# EAGLE design main (EAGLE 9.6.1)
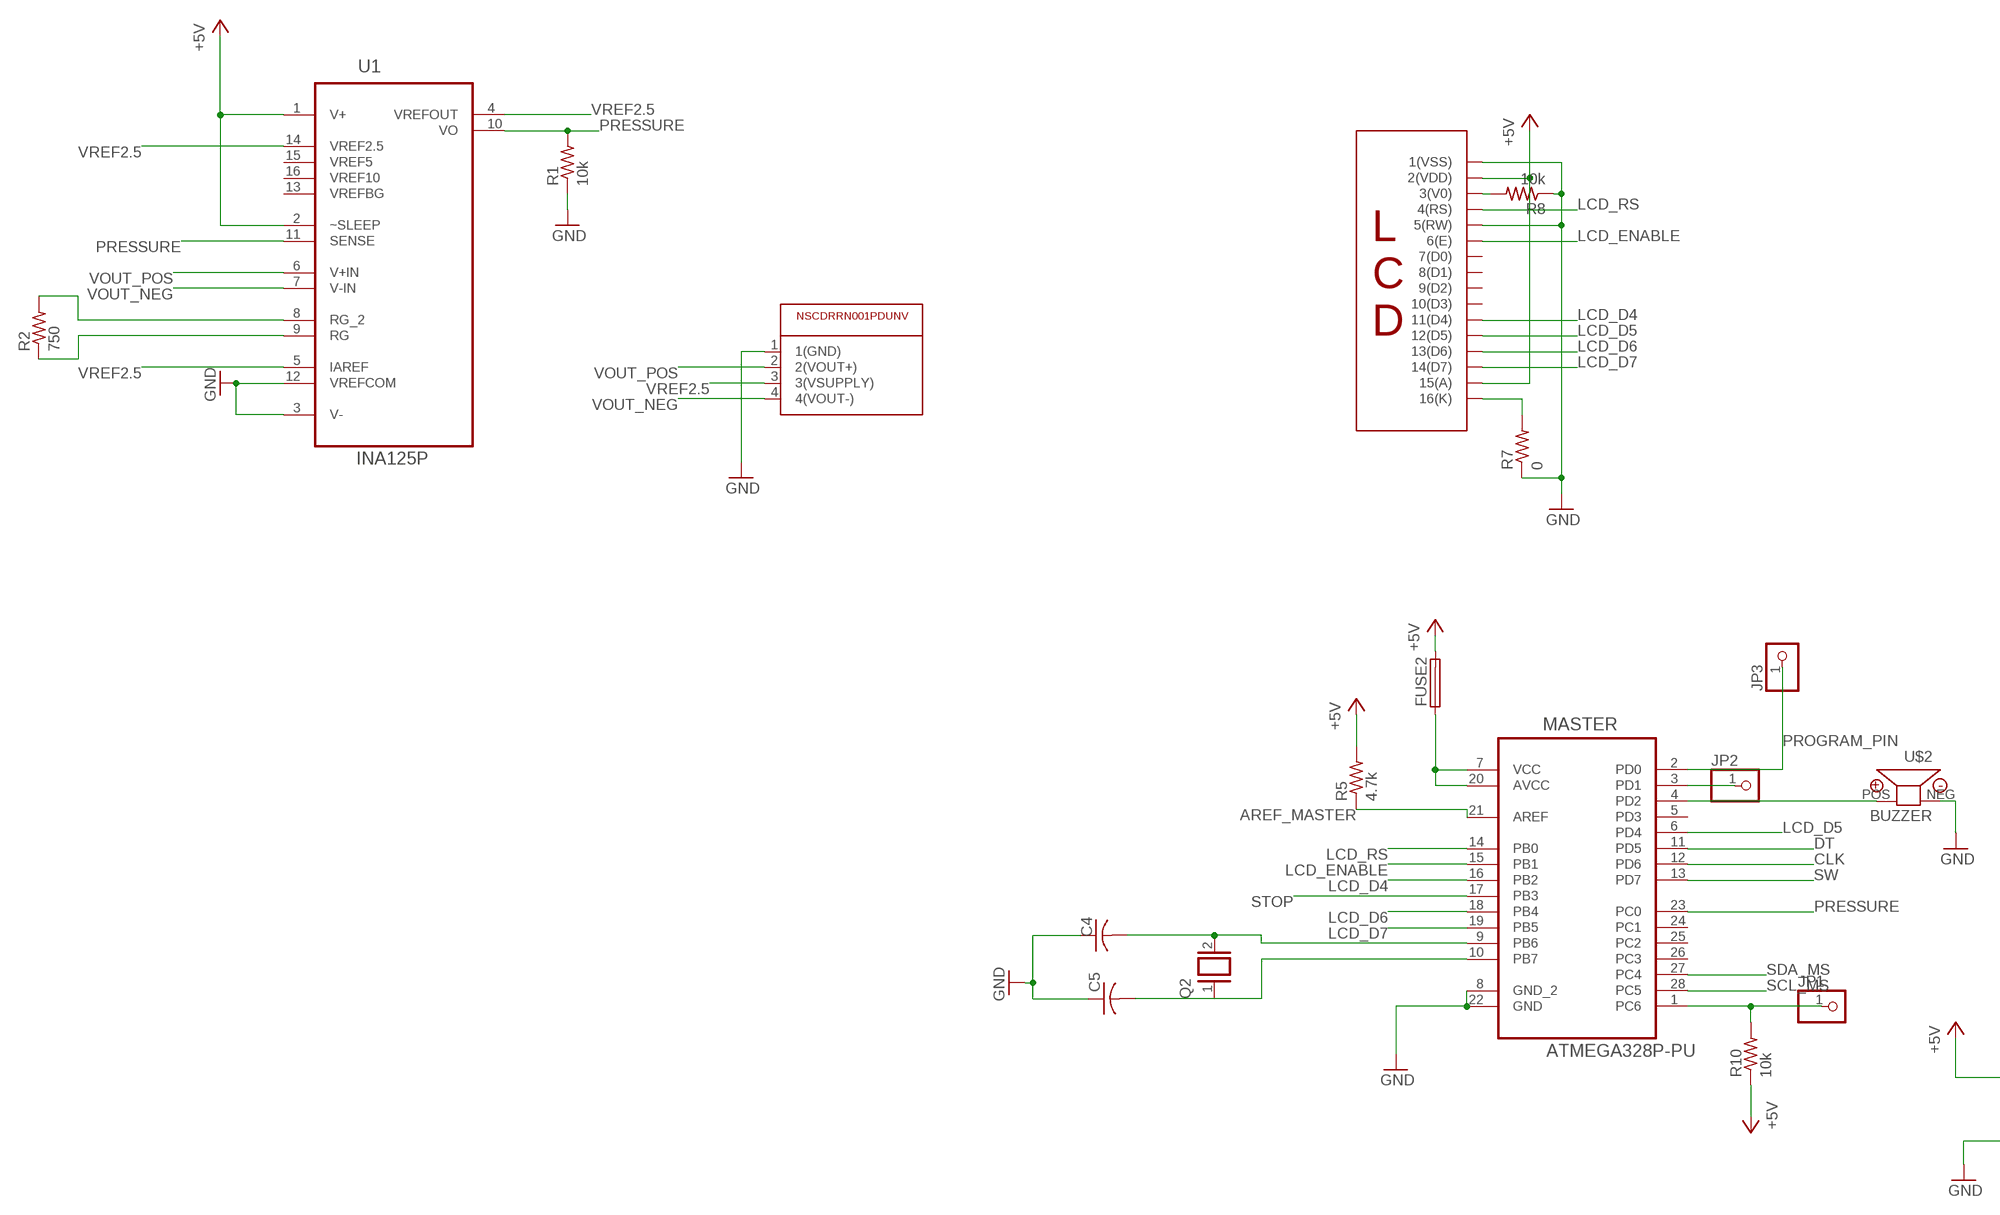
[diagram p0: schematic, sheet 1, part 1 of 2]
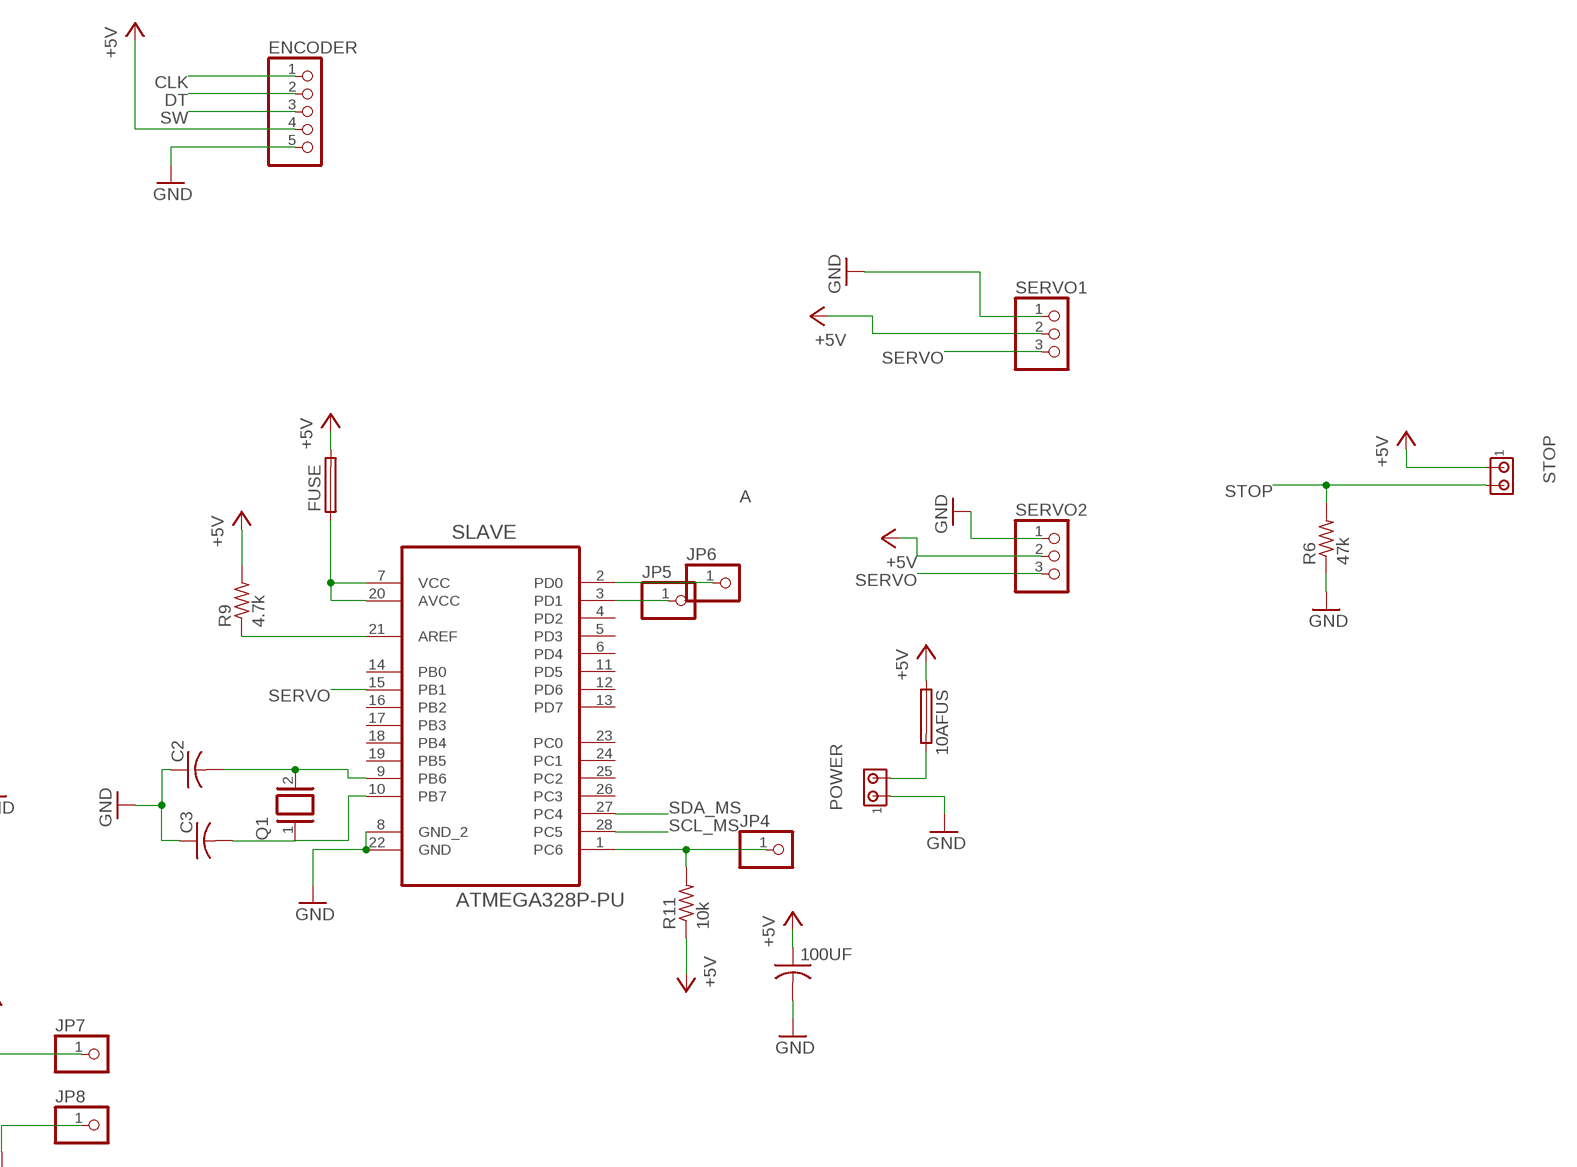
[diagram p1: schematic, sheet 1, part 2 of 2]

## Parts
10AFUS  FUSE050-075X075  [C050-075X075]
100UF  5MM_CAPACITOR050-075X075  [C050-075X075]
C2  5MM_CAPACITOR050-075X075  [C050-075X075]
C3  5MM_CAPACITOR050-075X075  [C050-075X075]
C4  5MM_CAPACITOR050-075X075  [C050-075X075]
C5  5MM_CAPACITOR050-075X075  [C050-075X075]
ENCODER  PINHD-1X5  [1X05]
FUSE  FUSE050-075X075  [C050-075X075]
FUSE2  FUSE050-075X075  [C050-075X075]
JP1  PINHD-1X1  [1X01]
JP2  PINHD-1X1  [1X01]
JP3  PINHD-1X1  [1X01]
JP4  PINHD-1X1  [1X01]
JP5  PINHD-1X1  [1X01]
JP6  PINHD-1X1  [1X01]
JP7  PINHD-1X1  [1X01]
JP8  PINHD-1X1  [1X01]
MASTER  ATMEGA328P-PU  [DIP254P762X457-28]
POWER  MTA02-156  [1X2MTA]
Q1  XTAL/S  [QS]
Q2  XTAL/S  [QS]
R1  10k  R-US_0207/10  [0207/10]
R2  750  R-US_0207/10  [0207/10]
R5  4.7k  R-US_0207/10  [0207/10]
R6  47k  R-US_0207/10  [0207/10]
R7  0  R-US_0207/10  [0207/10]
R8  10k  R-US_0207/10  [0207/10]
R9  4.7k  R-US_0207/10  [0207/10]
R10  10k  R-US_0207/10  [0207/10]
R11  10k  R-US_0207/10  [0207/10]
SERVO1  PINHD-1X3/90  [1X03/90]
SERVO2  PINHD-1X3/90  [1X03/90]
SLAVE  ATMEGA328P-PU  [DIP254P762X457-28]
STOP  MTA02-156  [1X2MTA]
U1  INA125P  [DIP254P762X508-16]
U$1  LCD  [1X16]
U$2  BUZZER  [BUZZER]
U$3  PRESSURE_SENSOR  [DIP8-WIDE]

## Nets
+5V: 10AFUS.1 100UF.1 ENCODER.4 FUSE2.2 FUSE.2 JP7.1 R5.2 R9.2 R10.1 R11.1 SERVO1.2 SERVO2.2 STOP.1 U1.1(V+) U1.2(~SLEEP) U$1.2(2(VDD)) U$1.15(15(A))
A: JP6.1 SLAVE.2(PD0)
AREF_MASTER: MASTER.21(AREF) R5.1
CLK: ENCODER.1 MASTER.12(PD6)
DT: ENCODER.2 MASTER.11(PD5)
GND: 100UF.2 C2.1 C3.1 C4.1 C5.1 ENCODER.5 JP8.1 MASTER.8(GND_2) MASTER.22(GND) POWER.1 R1.1 R6.1 R7.1 R8.1 SERVO1.1 SERVO2.1 SLAVE.8(GND_2) SLAVE.22(GND) U1.3(V-) U1.12(VREFCOM) U$1.1(1(VSS)) U$1.5(5(RW)) U$2.NEG U$3.1(1(GND))
LCD_D4: MASTER.16(PB2) U$1.11(11(D4))
LCD_D5: MASTER.6(PD4) U$1.12(12(D5))
LCD_D6: MASTER.18(PB4) U$1.13(13(D6))
LCD_D7: MASTER.19(PB5) U$1.14(14(D7))
LCD_ENABLE: MASTER.15(PB1) U$1.6(6(E))
LCD_RS: MASTER.14(PB0) U$1.4(4(RS))
N$1: JP2.1 MASTER.3(PD1)
N$2: FUSE2.1 MASTER.7(VCC) MASTER.20(AVCC)
N$4: FUSE.1 SLAVE.7(VCC) SLAVE.20(AVCC)
N$5: 10AFUS.2 POWER.2
N$6: R2.2 U1.8(RG_2)
N$7: C2.2 Q1.2 SLAVE.9(PB6)
N$8: C3.2 Q1.1 SLAVE.10(PB7)
N$9: JP1.1 MASTER.1(PC6) R10.2
N$10: JP4.1 R11.2 SLAVE.1(PC6)
N$11: C4.2 MASTER.9(PB6) Q2.2
N$12: JP5.1 SLAVE.3(PD1)
N$13: MASTER.4(PD2) U$2.POS
N$14: C5.2 MASTER.10(PB7) Q2.1
N$16: R7.2 U$1.16(16(K))
N$17: R8.2 U$1.3(3(V0))
N$18: R2.1 U1.9(RG)
N$19: R9.1 SLAVE.21(AREF)
PRESSURE: MASTER.23(PC0) R1.2 U1.10(VO) U1.11(SENSE)
PROGRAM_PIN: JP3.1 MASTER.2(PD0)
SCL_MS: MASTER.28(PC5) SLAVE.28(PC5)
SDA_MS: MASTER.27(PC4) SLAVE.27(PC4)
SERVO: SERVO1.3 SERVO2.3 SLAVE.15(PB1)
STOP: MASTER.17(PB3) R6.2 STOP.2
SW: ENCODER.3 MASTER.13(PD7)
VOUT_NEG: U1.7(V-IN) U$3.4(4(VOUT-))
VOUT_POS: U1.6(V+IN) U$3.2(2(VOUT+))
VREF2.5: U1.4(VREFOUT) U1.5(IAREF) U1.14(VREF2.5) U$3.3(3(VSUPPLY))
Unconnected: MASTER.5(PD3) MASTER.24(PC1) MASTER.25(PC2) MASTER.26(PC3) SLAVE.4(PD2) SLAVE.5(PD3) SLAVE.6(PD4) SLAVE.11(PD5) SLAVE.12(PD6) SLAVE.13(PD7) SLAVE.14(PB0) SLAVE.16(PB2) SLAVE.17(PB3) SLAVE.18(PB4) SLAVE.19(PB5) SLAVE.23(PC0) SLAVE.24(PC1) SLAVE.25(PC2) SLAVE.26(PC3) U$1.7(7(D0)) U$1.8(8(D1)) U$1.9(9(D2)) U$1.10(10(D3))

## Power pins joined to a net without a drawn wire
VREF5: U1.15(VREF5)
VREF10: U1.16(VREF10)
VREFBG: U1.13(VREFBG)

## Library data of the parts
10AFUS FUSE FUSE2 = e-vent:FUSE: CAPACITOR, American symbol
100UF C2-C5 = e-vent:5MM_CAPACITOR: CAPACITOR, American symbol
ENCODER = pinhead:PINHD-1X5: PIN HEADER
JP1-JP8 = pinhead:PINHD-1X1: PIN HEADER
MASTER SLAVE = e-vent:ATMEGA328P-PU: 8-bit Microcontroller with In-System Programmable Flash; AVAILABILITY: Unavailable; DESCRIPTION: AVR AVR® ATmega Microcontroller IC 8-Bit 20MHz 32KB _16K x 16_ FLASH 28-PDIP; MF: Microchip; MP: ATMEGA328P-PU; PACKAGE: PDIP-28 Microchip; PRICE: None
POWER STOP = con-amp:MTA02-156: AMP connector
Q1 Q2 = e-vent:XTAL/S: CRYSTAL
R1 R2 R5-R11 = rcl:R-US_: RESISTOR, American symbol; SPICEPREFIX: R
SERVO1 SERVO2 = pinhead:PINHD-1X3: PIN HEADER
U1 = e-vent:INA125P: INSTRUMENTATION AMPLIFIER; AVAILABILITY: Unavailable; DESCRIPTION: Instrumentation Amplifier 1 Circuit 16-PDIP; MF: Texas Instruments; MP: INA125P; PACKAGE: DIP-16 Burr Brown; PRICE: None
U$1 = e-vent:LCD
U$2 = e-vent:BUZZER
U$3 = e-vent:PRESSURE_SENSOR

## Board
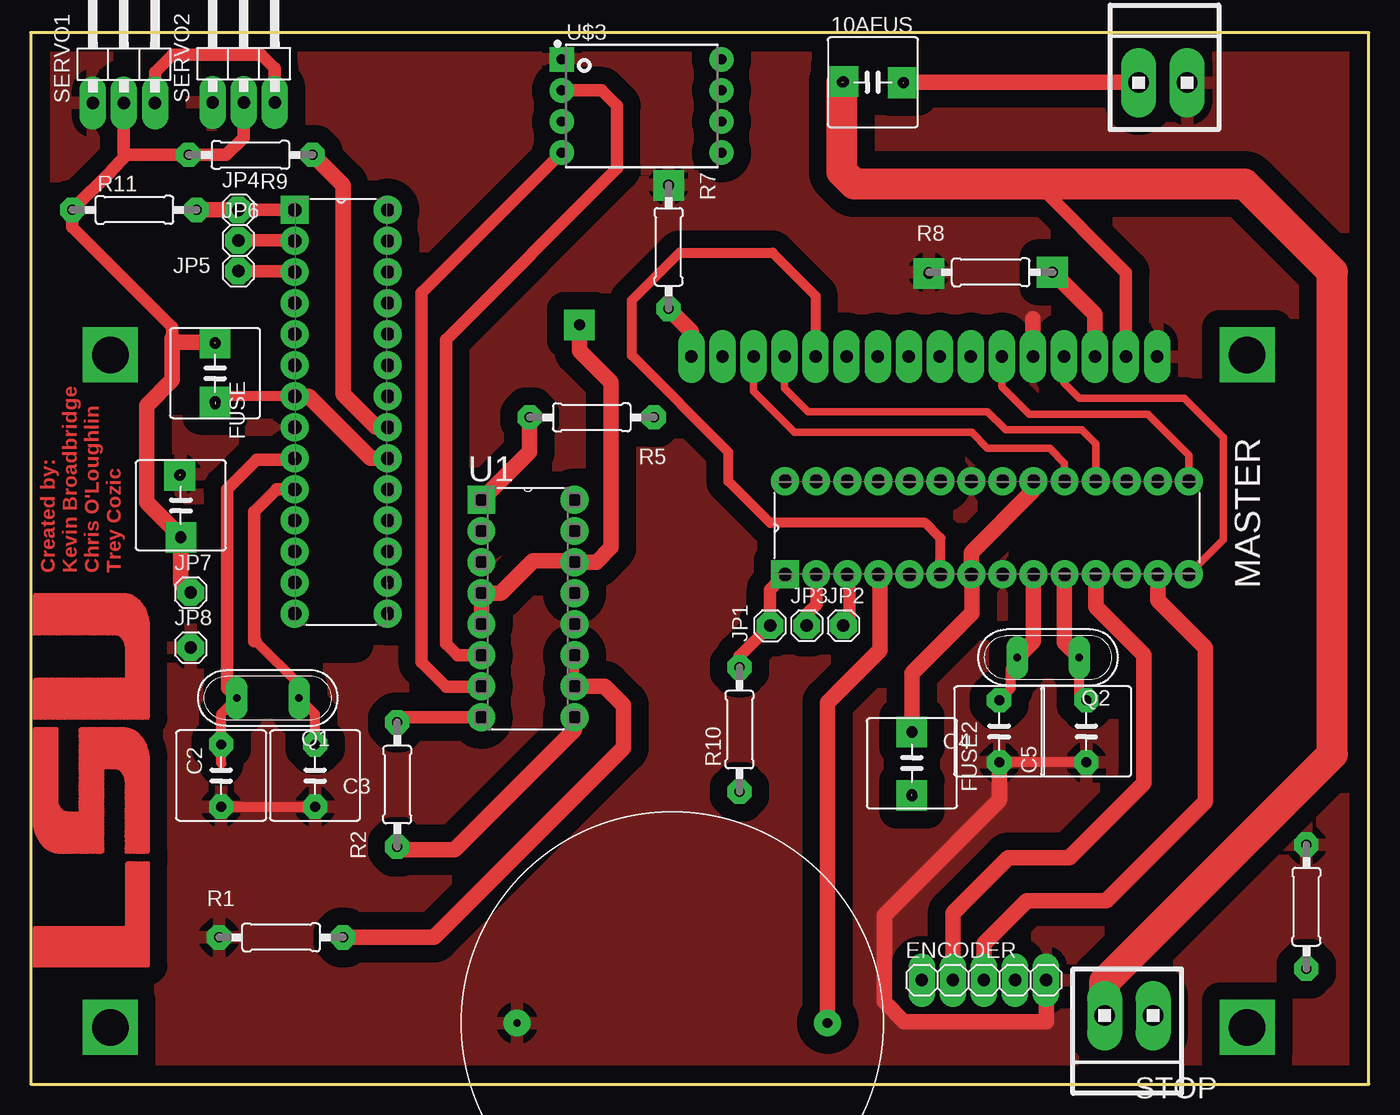
[diagram p2: board, top side]
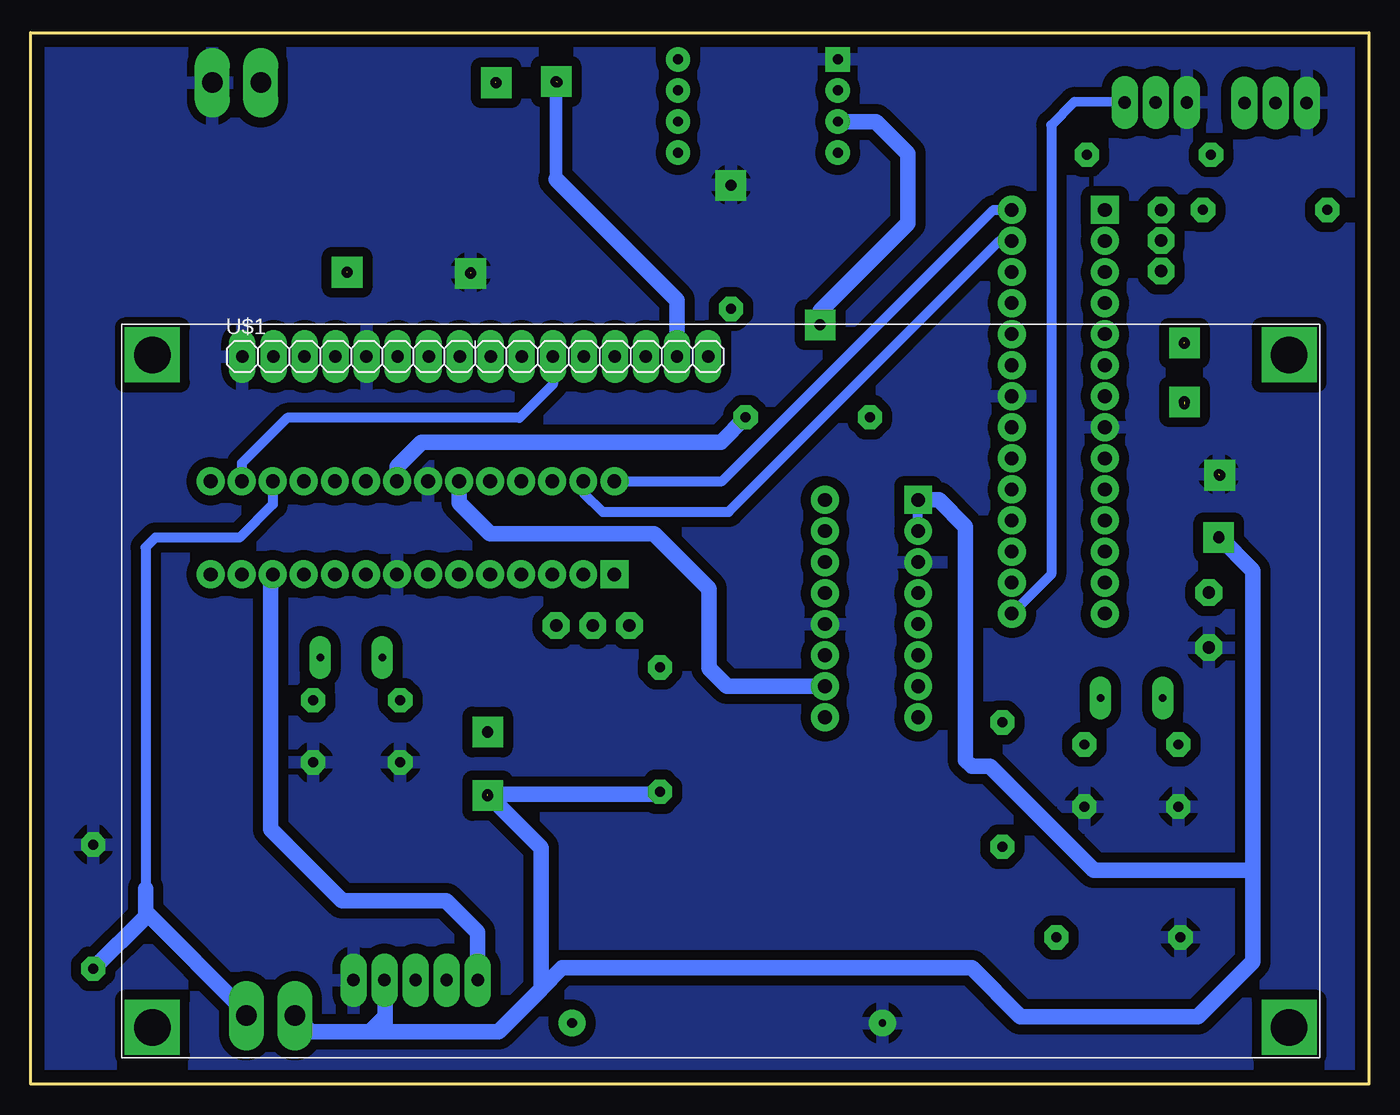
[diagram p3: board, bottom side, seen from below]

Size 109.5 x 86 mm. Coordinates in mm from the lower left corner, seen from the top.
Outline: 0,0 109.5,0 109.5,86 0,86 0,0
Copper layers (1*16): Top 0.035mm / dielectric 1.5mm / Bottom 0.035mm
Design rules "default *": minimum track width 8mil, minimum drill 0.35mm, track to track 6mil, track to pad 6mil, pad to pad 6mil, via to via 6mil, smd to smd 6mil, copper to edge 40mil, drill to drill 6mil, minimum pad ring 23mil, minimum via ring 8mil, stop-mask expansion 0mil, vias tented up to drill 0mil, thermal gap 25mil
tRestrict: area 24.2,35.9 to 26.6,50.8

### Footprints (pad centres in the part's own frame; a part is rotated, then mirrored left to right if it is on the bottom)
C050-075X075 = drill 0.813 octagon: 1 -2.54,0; 2 2.54,0
1X05 = drill 1.016 long: 1 -5.08,0; 2 -2.54,0; 3 0,0; 4 2.54,0; 5 5.08,0
1X01 = drill 1.016 octagon: 1 0,0
DIP254P762X457-28 = drill 1.118 square: 1 -7.62,33.02 | drill 1.118: 2 -7.62,30.48; 3 -7.62,27.94; 4 -7.62,25.4; 5 -7.62,22.86; 6 -7.62,20.32; 7 -7.62,17.78; 8 -7.62,15.24; 9 -7.62,12.7; 10 -7.62,10.16; 11 -7.62,7.62; 12 -7.62,5.08; 13 -7.62,2.54; 14 -7.62,0; 15 0,0; 16 0,2.54; 17 0,5.08; 18 0,7.62; 19 0,10.16; 20 0,12.7; 21 0,15.24; 22 0,17.78; 23 0,20.32; 24 0,22.86; 25 0,25.4; 26 0,27.94; 27 0,30.48; 28 0,33.02
1X2MTA = drill 1.676 long: 1 1.981,0; 2 -1.981,0
QS = drill 0.61 long: 1 -2.54,0; 2 2.54,0
0207/10 = drill 0.813 octagon: 1 -5.08,0; 2 5.08,0
1X03/90 = drill 1.016 long: 1 -2.54,-3.81; 2 0,-3.81; 3 2.54,-3.81
DIP254P762X508-16 = drill 1.118 square: 1 -7.62,17.78 | drill 1.118: 2 -7.62,15.24; 3 -7.62,12.7; 4 -7.62,10.16; 5 -7.62,7.62; 6 -7.62,5.08; 7 -7.62,2.54; 8 -7.62,0; 9 0,0; 10 0,2.54; 11 0,5.08; 12 0,7.62; 13 0,10.16; 14 0,12.7; 15 0,15.24; 16 0,17.78
1X16 = drill 1.016 long: 1 -39.14,26.1; 2 -36.6,26.1; 3 -34.06,26.1; 4 -31.52,26.1; 5 -28.98,26.1; 6 -26.44,26.1; 7 -23.9,26.1; 8 -21.36,26.1; 9 -18.82,26.1; 10 -16.28,26.1; 11 -13.74,26.1; 12 -11.2,26.1; 13 -8.66,26.1; 14 -6.12,26.1; 15 -3.58,26.1; 16 -1.04,26.1 | drill 3 square: P$1 -46.5,26.23; P$2 46.5,26.23; P$3 -46.5,-28.77; P$4 46.5,-28.77
BUZZER = drill 0.6 pad 2.184: NEG -12.7,0 | drill 0.8 pad 2.184: POS 12.7,0
DIP8-WIDE = drill 0.813 pad 1.4 square: 1 -6.54,3.81 | drill 0.813 pad 1.4: 2 -6.54,1.27; 3 -6.54,-1.27; 4 -6.54,-3.81; 5 6.54,-3.81; 6 6.54,-1.27; 7 6.54,1.27; 8 6.54,3.81

### Placement (x,y rotation side)
10AFUS  68.91,81.94 0 top
100UF  12.3,47.34 90 top
C2  15.6,25.24 90 top
C3  23.28,25.24 90 top
C4  79.25,28.85 90 top
C5  86.37,28.85 90 top
ENCODER  78,8.5 0 top
FUSE  15.1,58.15 90 top
FUSE2  72.1,26.24 270 top
JP1  60.5,37.5 90 top
JP2  66.5,37.5 0 top
JP3  63.5,37.5 0 top
JP4  17,71.5 0 top
JP5  17,66.5 0 top
JP6  17,69 0 top
JP7  13.1,40.2 0 top
JP8  13.1,35.7 0 top
MASTER  94.76,49.31 90 top
POWER  92.64,81.9 0 top
Q1  19.42,31.58 180 top
Q2  83.26,34.9 180 top
R1  20.5,12 0 top
R2  30,24.5 90 top
R5  45.92,54.53 180 top
R6  104.38,14.51 270 top
R7  52.2,68.48 270 top
R8  78.56,66.4 0 top
R9  18,76 180 top
R10  58,29 90 top
R11  8.5,71.5 0 top
SERVO1  7.64,84.06 0 top
SERVO2  17.44,84.1 0 top
SLAVE  29.22,38.48 0 top
STOP  89.86,5.6 180 top
U1  44.5,30 0 top
U$1  53.03,33.41 0 bottom
U$2  52.5,5 0 top
U$3  50,80 0 top

### Tracks (layer width: path | path; a pad name or v marks a point on that pad's centre or on a via)
+5V  (via drill 0.9 pad 2.5)  (3 unrouted)
  Top 1.016: 11.6,61 11.6,61.9 3.42,70.08 R11.1 | 17.42,80.33 SERVO2.2 17.44,77.42 16.02,76 R9.2 7.92,76 R11.1 | SERVO1.2 7.64,75.75 6.62,74.73 6.62,74.7 R11.1 | U$1.2 89.63,66.37 82.4,73.6
  Top 1.27: U1.1 40.84,51.74 R5.2 | FUSE.2 11.91,60.69 11.6,61 11.6,57.6 9.5,55.5 9.5,47.6 100UF.1 v12.3,44.7 12.3,41 JP7.1
  Top 2.54: STOP.1 87.88,8.38 106.5,27 106.5,66.44 99.34,73.6 82.4,73.6 67.4,73.6 66.37,74.63 10AFUS.1
  Bottom 0.813: U1.2 U1.1
  Bottom 1.016: 66.5,74 66.5,81.81
  Bottom 1.27: STOP.1 86.58,4.3 80.5,4.3 80.5,5.5 | 80.5,5.5 81.7,4.3 71.2,4.3 67.75,7.75 | 67.75,7.75 66,9.5 32.5,9.5 28.5,5.5 14,5.5 9.5,10 9.5,17.5 | 100UF.1 9.5,42 9.5,17.5 | 67.75,7.75 67.75,19.35 FUSE2.2 58.22,23.7 R10.1 | R5.2 40.8,54.5 | 9.5,17.5 22.5,17.5 31,26 32.5,26 33,26.5 33,45.6 35.18,47.78 U1.1 | 66.5,74 56.61,64.11 U$1.15 | 66.5,81.81 10AFUS.1 | 80.5,5.5 80.5,8.46 ENCODER.4
  other vias: 15.1,60.6 66.5,82 72.1,23.6
A
  Top 1.016: SLAVE.2 21.56,69 JP6.1
AREF_MASTER
  Bottom 1.27: MASTER.21 79.52,50.48 77.5,52.5 53.03,52.5 R5.1
CLK
  Bottom 1.27: ENCODER.1 72.92,12.42 75.5,15 84,15 89.87,20.87 89.87,41.5 MASTER.12
DT
  Top 1.27: MASTER.11 87.14,39.06 91.1,35.1 91.1,24.6 85,18.5 80,18.5 75.46,13.96 ENCODER.2
GND  (via drill 0.9 pad 2.5)  (2 unrouted)
  Top 0.813: 15.7,22.8 C2.1 | C4.1 C5.1 86.43,26.37 | 17.2,22.7 C2.1 | C2.1 C3.1
  Top 1.27: ENCODER.5 83.1,8.48 83.1,5.1 71.47,5.1 69.84,6.73 69.84,13.82 79.25,23.23 C4.1 | U$1.5 82.01,62.59 82,62.6
  other vias: 52.2,73.5 12.2,49.8 73.5,66.3
  pour Top (isolate 1.422): -4.31,1.19 -4.31,87.32 110.91,87.32 110.91,1.19
  pour Bottom (isolate 0.813): -6.38,-0.71 -6.38,90.09 112.41,90.09 112.41,-0.71
LCD_D4
  Bottom 0.813: U$1.11 66.77,57.23 69.5,54.5 88.5,54.5 92.22,50.78 MASTER.16
LCD_D5
  Top 0.813: MASTER.6 74.44,44.66 73.2,45.9 60.5,45.9 57.1,49.3 57.1,51.7 49.2,59.6 49.2,64.1 53.1,68 60.7,68 64.23,64.47 U$1.12
LCD_D6
  Top 0.61: U$1.13 61.69,56.91 63.6,55 78.3,55 79.8,53.5 86,53.5 87.14,52.36 MASTER.18
LCD_D7
  Top 0.61: MASTER.19 84.6,50.8 83.4,52 78.3,52 77,53.3 62.5,53.3 59.15,56.65 U$1.14
LCD_ENABLE
  Top 0.61: MASTER.15 94.76,51.44 91.4,54.8 81.7,54.8 79.47,57.03 U$1.6
LCD_RS
  Top 0.61: MASTER.14 97.6,44.53 97.6,52.9 94.4,56.1 85.8,56.1 84.55,57.35 U$1.4
N$1
  Top 1.016: MASTER.3 66.82,41.05 67,40.87 67,38 JP2.1
N$2  (via drill 0.9 pad 2.5)
  Top 1.27: FUSE2.1 v72.1,28.8 72.1,33.6 77,38.5 77,41.67 MASTER.7 76.98,43.48 82.06,48.56 MASTER.20
N$4  (via drill 0.9 pad 2.5)  (1 unrouted)
  Top 0.813: SLAVE.7 15.75,56.26 FUSE.1
  Top 1.27: SLAVE.20 27.82,51.18 22.74,56.26 SLAVE.7
  other vias: 15.1,55.8
N$5  (via drill 0.9 pad 2.5)  (1 unrouted)
  Top 1.27: 10AFUS.2 90.62,81.94 POWER.2
  other vias: 71.4,81.9
N$6
  Top 1.016: R2.2 30.42,30 U1.8
N$7
  Top 0.813: Q1.2 15.6,30.3 C2.2 15.6,26.22
  Top 1.016: Q1.2 16.08,32.38 16.08,48.66 18.5,51.08 21.5,51.08
  Top 1.27: SLAVE.9 21.5,51.08
N$8
  Top 0.813: 18.43,36.23 21.96,32.7 Q1.1 23.28,30.26 C3.2
  Top 1.016: 18.43,36.23 18.3,36.23 18.3,46.8 20.14,48.64 SLAVE.10
N$9
  Top 1.016: R10.2 58,35 JP1.1 60.5,40.45 MASTER.1
N$10
  Top 1.016: SLAVE.1 JP4.1
  Top 1.27: JP4.1 R11.2
N$11
  Top 0.61: 82.06,39.96 MASTER.9
  Top 0.813: Q2.2 80.72,34.1 80.22,33.6 | 80.22,33.6 80.22,34.02 | 79.29,31.35 C4.2 80.2,32.34 80.2,33.58 80.22,33.6
  Top 1.27: Q2.2 82.06,36.24 MASTER.9
N$12
  Top 1.016: SLAVE.3 21.52,66.5 JP5.1
N$13
  Top 1.27: U$2.POS 65.2,31.2 69.5,35.5 69.5,41.55 MASTER.4
N$14
  Top 0.61: 84.6,40.49 MASTER.10
  Top 0.813: 86.43,31.33 C5.2 85.8,31.96 Q2.1
  Top 1.27: Q2.1 84.6,36.1 MASTER.10
N$16
  Top 1.016: U$1.16 53.71,59.87 53.71,60.01 54.1,60.78
  Top 1.27: U$1.16 54.07,61.53 R7.2
N$17  (via drill 0.9 pad 2.5)  (1 unrouted)
  Top 0.813: 86.99,59.61 U$1.3
  Top 1.27: U$1.3 87.09,62.95 R8.2
  other vias: 83.6,66.4
N$18
  Top 1.27: R2.1 30.25,19.17 34.67,19.17 44.5,29 U1.9
N$19
  Top 1.27: SLAVE.21 28.28,53.72 25.58,56.42 25.58,73.5 R9.1
PRESSURE
  Top 0.813: U1.10 U1.11
  Top 1.27: R1.2 33,12 48.5,27.5 48.5,31 46.96,32.54 U1.10
  Bottom 1.27: 74.5,49.25 MASTER.23 74.45,49.3 74.45,47.54 71.91,45 58.5,45 54,40.5 54,34 52.54,32.54 U1.10
PROGRAM_PIN
  Top 1.016: MASTER.2 64.28,39.19 63.5,38.41 JP3.1
SCL_MS
  Bottom 0.813: SLAVE.28 30.72,71.5 52.91,49.31 MASTER.28
SDA_MS
  Bottom 0.813: MASTER.27 64.28,48.38 62.7,46.8 52.38,46.8 30.22,68.96 SLAVE.27
SERVO
  Top 1.016: SERVO2.3 19.98,83.09 18.87,84.2 11.63,84.2 10.18,82.75 SERVO1.3
  Bottom 0.813: SERVO2.3 24.11,80.33 26,78.43 26,41.7 SLAVE.15
STOP
  Bottom 0.813: MASTER.17 89.68,47.42 92.4,44.7 99.3,44.7 100.1,43.9 100.1,16
  Bottom 1.27: 100.1,16 100.1,14.1 | STOP.2 91.84,5.84 100.1,14.1 | R6.2 100.1,13.71 100.1,14.1
SW
  Top 1.27: MASTER.13 92.22,39.58 96.1,35.7 96.1,23.1 88,15 81.5,15 78,11.5 ENCODER.3
VOUT_NEG
  Top 1.016: U$3.4 32,64.73 32,34.5 34,32.5 36.84,32.5
  Top 1.27: 36.84,32.5 U1.7
VOUT_POS
  Top 1.016: U$3.2 46.73,81.27 48,80 48,74.9 34,60.9 34,36 34.92,35.08 U1.6
VREF2.5  (via drill 0.9 pad 2.5)
  Top 0.813: U1.4 38.09,40.16
  Top 1.27: U1.5 U1.4 38.46,40.16 41.1,42.8 44.4,42.8 U1.14 46.3,42.7 47.5,43.9 47.5,57.4 44.9,60 v44.9,62.1
  Bottom 1.27: v44.9,62.1 44.9,63.2 37.7,70.4 37.7,76.1 40.33,78.73 U$3.3
(copper drawn outside any net)
  shapes: Top area x2330

### Text on the board
Top: Created by: / Kevin Broadbridge / Chris O'Loughlin / Trey Cozic